# Altium schematic sheet osc_blank.SchDoc
size Letter; SheetNumber: 5; SheetTotal: 9
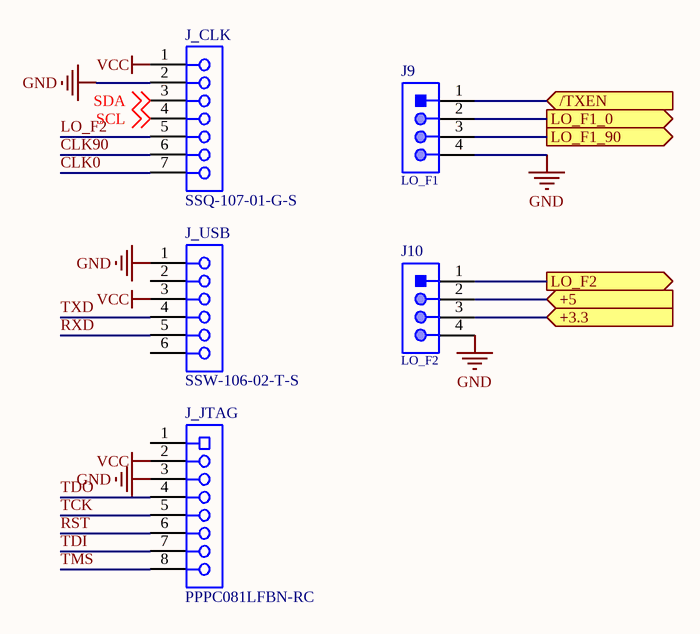
[diagram p0: osc_blank.SchDoc]

## Parts
J9  LO_F1  [61300411121]
J10  LO_F2  [61300411121]
J_CLK  SSQ-107-01-G-S  [SMTC-SSQ-107-01-X-S]
J_JTAG  PPPC081LFBN-RC  [SLIN-PPPC081LFBN-RC_V]
J_USB  SSW-106-02-T-S  [SMTC-SSW-106-02-X-S]

## Ports
+3.3 (in), +5 (in), /TXEN (in), LO_F1_0 (out), LO_F1_90 (out), LO_F2 (out)

## Nets
GND: J9.4 J10.4 J_CLK.2 J_JTAG.3 J_USB.1
VCC: J_CLK.1 J_JTAG.2 J_USB.3
+3.3: J10.3 ; port +3.3
+5: J10.2 ; port +5
/TXEN: J9.1 ; port /TXEN
CLK0: J_CLK.7
CLK90: J_CLK.6
LO_F1_0: J9.2 ; port LO_F1_0
LO_F1_90: J9.3 ; port LO_F1_90
LO_F2: J10.1 ; port LO_F2
LO_F2: J_CLK.5  [a separate net that carries the same name]
RST: J_JTAG.6
RXD: J_USB.5
SCL: J_CLK.4 ; off-sheet SCL
SDA: J_CLK.3 ; off-sheet SDA
TCK: J_JTAG.5
TDI: J_JTAG.7
TDO: J_JTAG.4
TMS: J_JTAG.8
TXD: J_USB.4

Not connected (* = marked no-connect by the designer): J_JTAG 1; J_USB 2 6

## Library data of the parts
J9 J10 = CMP-1502-01064-1: THT Vertical Pin Header WR-PHD, Pitch 2.54 mm, Single Row, 4 pins; Manufacturer: Wurth Elektronik; Withstanding Voltage: 500VAC; Rated Current: 3A; Working Voltage: 250VAC; Pin Number: 4; Gender: Male; Contact Resistance: 20mOhm; Pitch: 2.54mm; Manufacturer URL: http://www.we-online.de; Operating Temperature: -40to105degC; Packaging: Bag; Mounting Technology: THT; Package Reference: 61300411121; Datasheet URL: https://katalog.we-online.de/em/datasheet/6130xx11121.pdf; Publisher: WurthElektronik; Part Number: 61300411121; Row Number: Single; Orientation: Vertical
J_CLK = CMP-1023-00284-1: SQ Post Socket, Through-hole, Vertical, -55 to 125 degC, 2.54 mm Pitch, 7-Pin, Female, RoHS; Manufacturer: Samtec; Pitch: 2.54 mm; PackageDescription: Assembly, Socket Strip .025[0.64] SQ Tail; PartNumber: SSQ-107-01-G-S; PackageReference: SSQ-107-01-X-S; ComponentLink2URL: http://www.samtec.com/documents/webfiles/pdf/SSQ_TH.PDF; ComponentLink1URL: http://www.samtec.com; ComponentLink3Description: Package Specification; PackageVersion: BD, 6/1987; RoHS: True; DatasheetVersion: F-214; Mounting Technology: Through-hole; ComponentLink3URL: http://www.samtec.com/documents/webfiles/cpdf/SSQ-1XX-XX-XXX-X-XX-XXX-XX-X-MKT.pdf; ComponentLink1Description: Manufacturer URL; Temperature Range: -55 to 125 degC; Orientation: Vertical; ComponentLink2Description: Datasheet
J_JTAG = CMP-1770-00002-1: Female Header, Pitch 2.54 mm, 1 x 8 Position, Height 8.5 mm, Tail Length 3.2 mm, -40 to 105 degC, RoHS, Bulk; Case\Package: TO-252-3; Rds On Max: 115 mohm; Typical Rise Time: 90 ns; Max Power Dissipation: 2.5 W; Input Capacitance: 350 pF; Elements: 1; Height: 2.39 mm; Min Operating Temperature: -55 degC; RoHSCompliant: true; PackageDescription: Female Header, Pitch 2.54 mm, 1 x 8 Position, Height 8.5 mm, Tail Length 3.2 mm; Length: 6.73 mm; ComponentLink1Description: Datasheet; Package Quantity: 2500; Max Operating Temperature: 150 degC; Width: 6.22 mm; Radiation Hardening: No; Packaging: Tape and Reel; REACH SVHC: No SVHC; Pins: 3; PackageReference: PPPC081LFBN-RC; ComponentLink1URL: http://sullinscorp.com/catalogs/101_PAGE114-115_.100_FEMALE_HDR.pdf; DatasheetVersion: Jan-15; Mount: Surface Mount
J_USB = CMP-1023-00360-1: SQ Post Socket, Through-hole, Vertical, -55 to 105 degC, 2.54mm Pitch, 6-Pin, Female, RoHS; Manufacturer: Samtec; ComponentLink1URL: http://www.samtec.com; Temperature Range: -55 to 105 degC; Pitch: 2.54 mm; Mounting Technology: Through-hole; DatasheetVersion: F-214; ComponentLink1Description: Manufacturer URL; PackageVersion: CA, 6/1987; ComponentLink3Description: Package Specification; PackageDescription: Assembly, Socket Strip .016 X .031 Tail; ComponentLink2Description: Datasheet; ComponentLink2URL: http://www.samtec.com/documents/webfiles/pdf/SSW_TH.PDF; PackageReference: SSW-106-02-X-S; ComponentLink3URL: http://www.samtec.com/documents/webfiles/cpdf/SSW-1XX-XX-XXX-X-XX-XXX-XX-MKT.pdf; RoHS: True; PartNumber: SSW-106-02-T-S; Orientation: Vertical